# Altium schematic sheet mcu.SchDoc
size A3; SheetNumber: 2; SheetTotal: 7
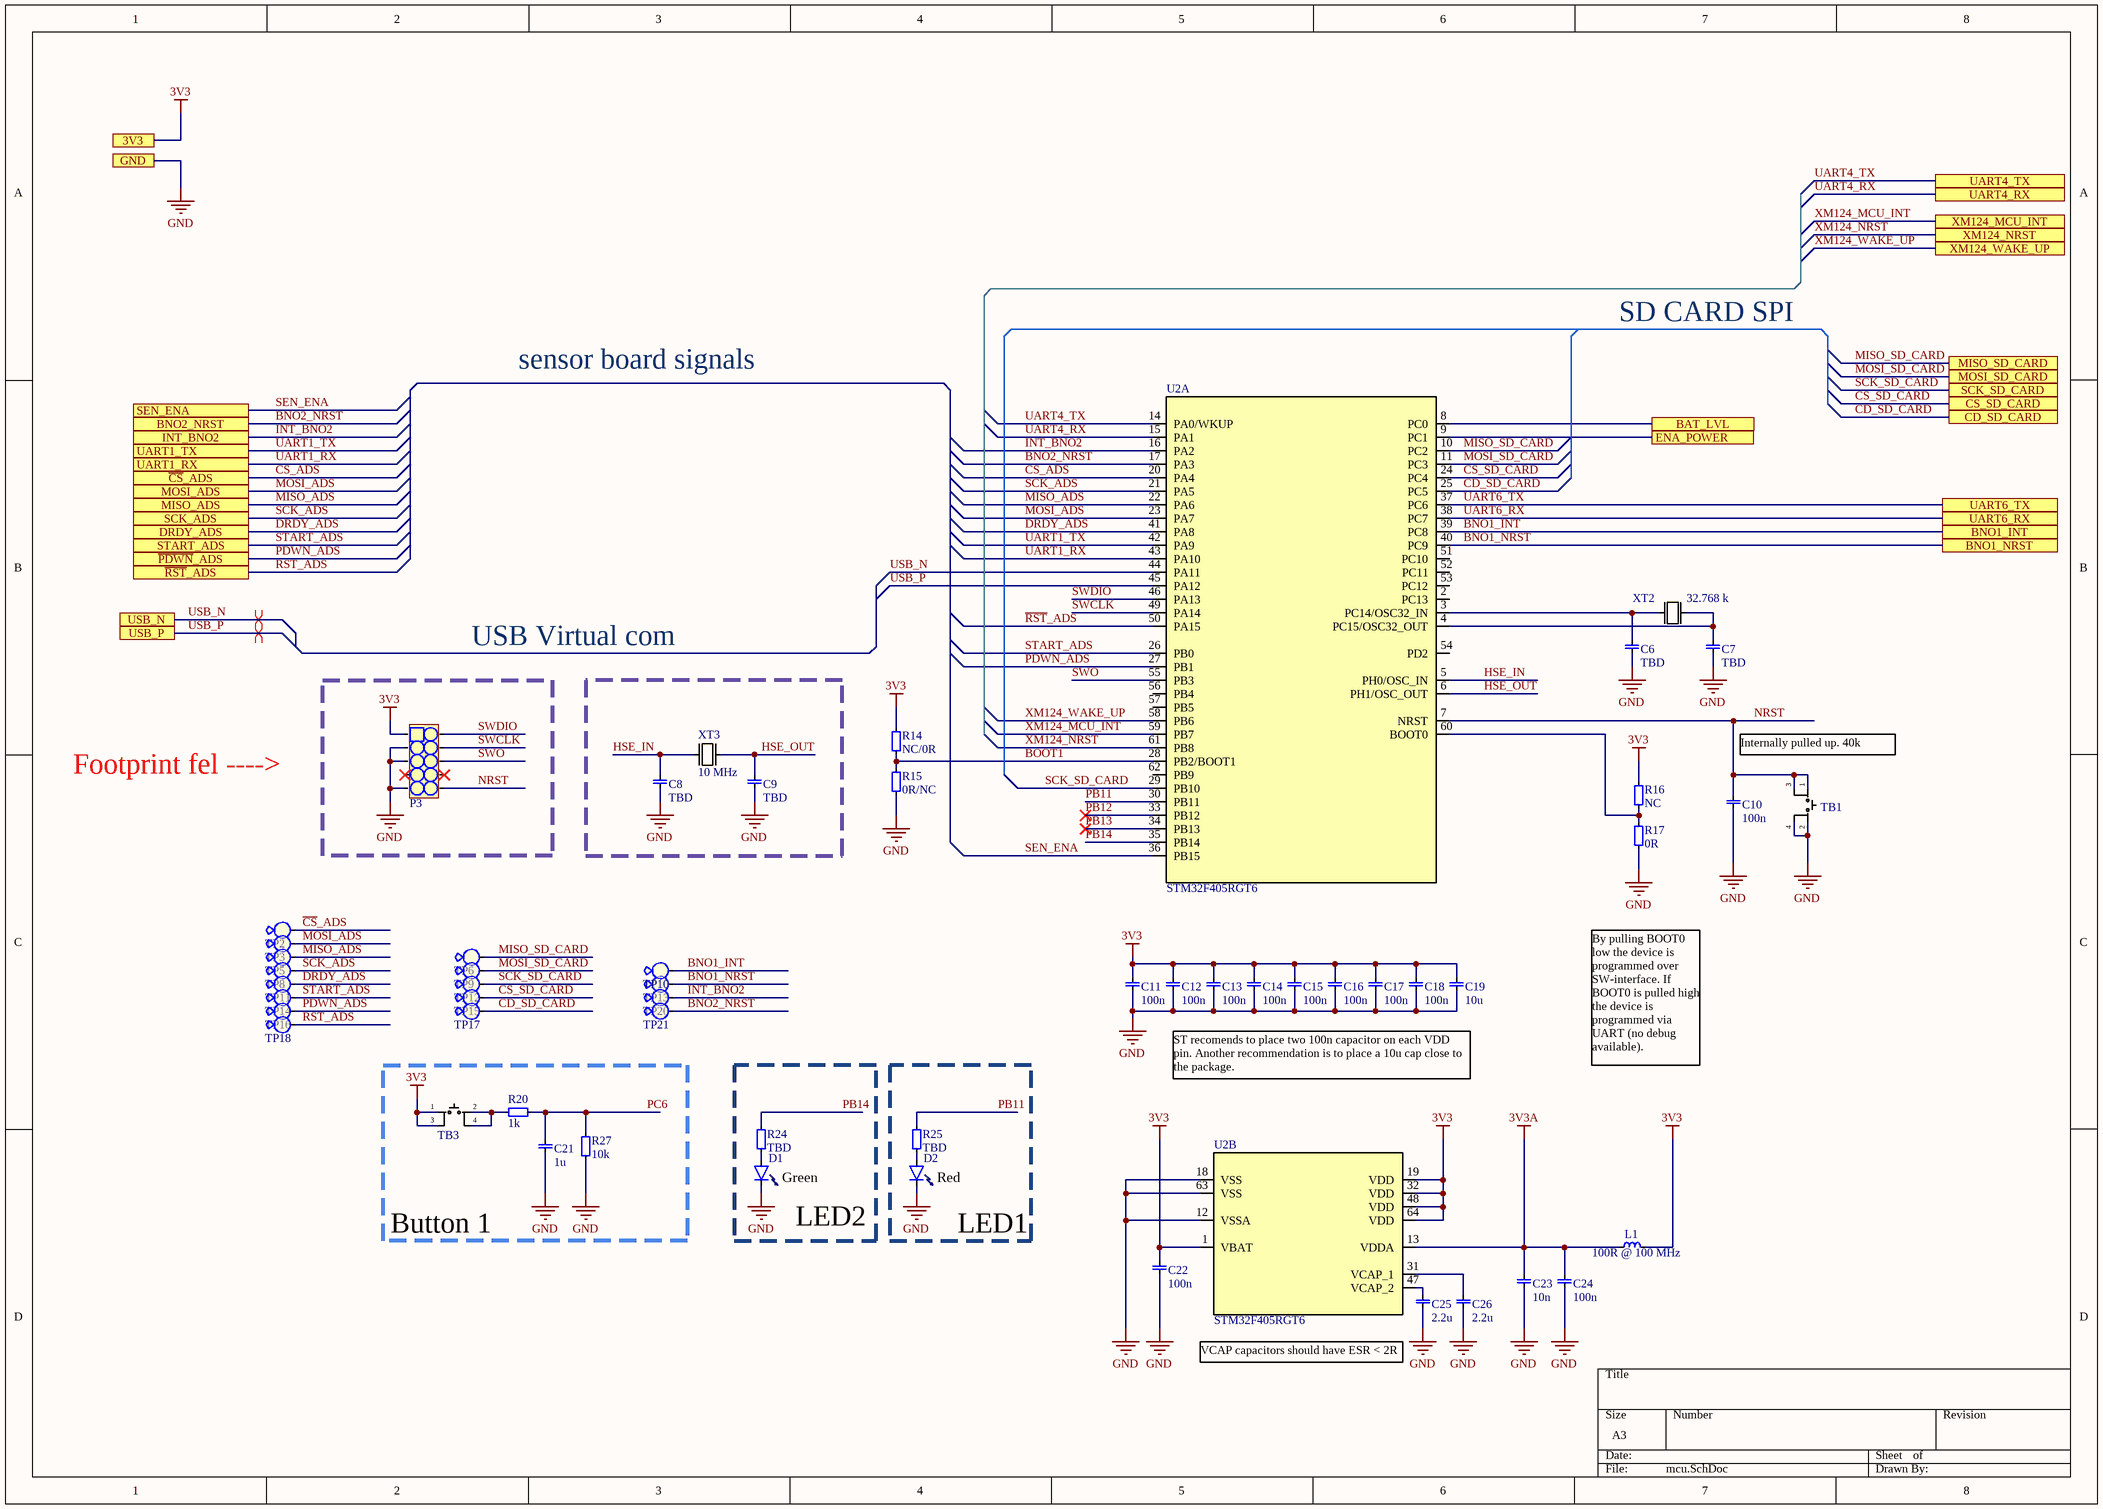
[diagram p0: mcu.SchDoc]

## Parts
C6  value TBD  [0603 cap]  (hidden comment: 0603, capacitor)
C7  value TBD  [0603 cap]  (hidden comment: 0603, capacitor)
C8  value TBD  [0603 cap]  (hidden comment: 0603, capacitor)
C9  value TBD  [0603 cap]  (hidden comment: 0603, capacitor)
C10  value 100n  [0402 CAP]  (hidden comment: 0603, capacitor)
C11  value 100n  [0402 CAP]  (hidden comment: 0603, capacitor)
C12  value 100n  [0402 CAP]  (hidden comment: 0603, capacitor)
C13  value 100n  [0402 CAP]  (hidden comment: 0603, capacitor)
C14  value 100n  [0402 CAP]  (hidden comment: 0603, capacitor)
C15  value 100n  [0402 CAP]  (hidden comment: 0603, capacitor)
C16  value 100n  [0402 CAP]  (hidden comment: 0603, capacitor)
C17  value 100n  [0402 CAP]  (hidden comment: 0603, capacitor)
C18  value 100n  [0402 CAP]  (hidden comment: 0603, capacitor)
C19  value 10u  [0402 CAP]  (hidden comment: 0603, capacitor)
C21  value 1u  [0402 CAP]  (hidden comment: 0603, capacitor)
C22  value 100n  [0402 CAP]  (hidden comment: 0603, capacitor)
C23  value 10n  [0402 CAP]  (hidden comment: 0603, capacitor)
C24  value 100n  [0402 CAP]  (hidden comment: 0603, capacitor)
C25  value 2.2u  [0402 CAP]  (hidden comment: 0603, capacitor)
C26  value 2.2u  [0402 CAP]  (hidden comment: 0603, capacitor)
D1  0603, LED  [0603 LED]  (value not drawn)
D2  0603, LED  [0603 LED]  (value not drawn)
L1  value 100R @ 100 MHz  [0805]  (hidden comment: 0805, Ferrite Bead)
P3  ARM 10 pin SWD  [FTSH-105-01-L-DV-K even odd]  (value not drawn)
R14  value NC/0R  [0402 res]  (hidden comment: 0603, resistor)
R15  value 0R/NC  [0402 res]  (hidden comment: 0603, resistor)
R16  value NC  [0402 res]  (hidden comment: 0603, resistor)
R17  value 0R  [0402 res]  (hidden comment: 0603, resistor)
R20  value 1k  [0402 res]  (hidden comment: 0603, resistor)
R24  value TBD  [0402 res]  (hidden comment: 0603, resistor)
R25  value TBD  [0402 res]  (hidden comment: 0603, resistor)
R27  value 10k  [0402 res]  (hidden comment: 0603, resistor)
TB1  Tactile Button  [tacButton smd]  (value not drawn)
TB3  Tactile Button  [tacButton smd]  (value not drawn)
TP2  Test Point  [testPoint]  (value not drawn)
TP3  Test Point  [testPoint]  (value not drawn)
TP5  Test Point  [testPoint]  (value not drawn)
TP6  Test Point  [testPoint]  (value not drawn)
TP8  Test Point  [testPoint]  (value not drawn)
TP9  Test Point  [testPoint]  (value not drawn)
TP10  Test Point  [testPoint]  (value not drawn)
TP11  Test Point  [testPoint]  (value not drawn)
TP12  Test Point  [testPoint]  (value not drawn)
TP13  Test Point  [testPoint]  (value not drawn)
TP14  Test Point  [testPoint]  (value not drawn)
TP15  Test Point  [testPoint]  (value not drawn)
TP16  Test Point  [testPoint]  (value not drawn)
TP17  Test Point  [testPoint]  (value not drawn)
TP18  Test Point  [testPoint]  (value not drawn)
TP20  Test Point  [testPoint]  (value not drawn)
TP21  Test Point  [testPoint]  (value not drawn)
U2  STM32F405RGT6  [LQFP64-10x10mm_s]  (parts A,B of 2)
XT2  value 32.768 k  [ECS-.327-12.5-39-TR]  (hidden comment: Crystal)
XT3  value 10 MHz  [XTAL_SMD_LP]  (hidden comment: XTAL TXC 7A)

## Blocks framed on the sheet
Button 1: C21 R20 R27 TB3
LED2: D1 R24
LED1: D2 R25

## Ports
3V3, BAT_LVL, BNO1_INT, BNO1_NRST, BNO2_NRST, CD_SD_CARD, CS_SD_CARD, DRDY_ADS, ENA_POWER, GND, INT_BNO2, MISO_ADS, MISO_SD_CARD, MOSI_ADS, MOSI_SD_CARD, SCK_ADS, SCK_SD_CARD, SEN_ENA, START_ADS, UART1_RX, UART1_TX, UART4_RX, UART4_TX, UART6_RX, UART6_TX, USB_N, USB_P, XM124_MCU_INT, XM124_NRST, XM124_WAKE_UP, ~{CS}_ADS, ~{PDWN}_ADS, ~{RST}_ADS

## Nets
3V3: C11.1 C12.1 C13.1 C14.1 C15.1 C16.1 C17.1 C18.1 C19.1 C22.1 L1.0 P3.1 R14.0 R16.0 TB3.1 TB3.3 U2.1(VBAT) U2.19(VDD) U2.32(VDD) U2.48(VDD) U2.64(VDD) ; port 3V3
3V3A: C23.1 C24.1 L1.1 U2.13(VDDA)
GND: C6.0 C7.0 C8.0 C9.0 C10.0 C11.0 C12.0 C13.0 C14.0 C15.0 C16.0 C17.0 C18.0 C19.0 C21.0 C22.0 C23.0 C24.0 C25.0 C26.0 D1.0(Cathode) D2.0(Cathode) P3.3 P3.5 P3.9 R15.1 R17.1 R27.0 TB1.2 TB1.4 U2.12(VSSA) U2.18(VSS) U2.63(VSS) ; port GND
BAT_LVL: U2.8(PC0) ; port BAT_LVL
BNO1_INT: TP10.0 U2.39(PC8) ; port BNO1_INT
BNO1_NRST: TP13.0 U2.40(PC9) ; port BNO1_NRST
BNO2_NRST: TP21.0 U2.17(PA3) ; port BNO2_NRST
BOOT1: R14.1 R15.0 U2.28(PB2/BOOT1)
~{CS}_ADS: TP2.0 U2.20(PA4) ; port ~{CS}_ADS
CD_SD_CARD: TP17.0 U2.25(PC5) ; port CD_SD_CARD
CS_SD_CARD: TP15.0 U2.24(PC4) ; port CS_SD_CARD
DRDY_ADS: TP11.0 U2.41(PA8) ; port DRDY_ADS
ENA_POWER: U2.9(PC1) ; port ENA_POWER
HSE_IN: C8.1 U2.5(PH0/OSC_IN) XT3.1
HSE_OUT: C9.1 U2.6(PH1/OSC_OUT) XT3.2
INT_BNO2: TP20.0 U2.16(PA2) ; port INT_BNO2
MISO_ADS: TP5.0 U2.22(PA6) ; port MISO_ADS
MISO_SD_CARD: TP6.0 U2.10(PC2) ; port MISO_SD_CARD
MOSI_ADS: TP3.0 U2.23(PA7) ; port MOSI_ADS
MOSI_SD_CARD: TP9.0 U2.11(PC3) ; port MOSI_SD_CARD
NRST: C10.1 P3.10 TB1.1 TB1.3 U2.7(NRST)
~{PDWN}_ADS: TP16.0 U2.27(PB1) ; port ~{PDWN}_ADS
PB11: R25.1 U2.30(PB11)
PB12: U2.33(PB12)
PB13: U2.34(PB13)
PB14: R24.1 U2.35(PB14)
PC6: C21.1 R20.1 R27.1
~{RST}_ADS: TP18.0 U2.50(PA15) ; port ~{RST}_ADS
SCK_ADS: TP8.0 U2.21(PA5) ; port SCK_ADS
SCK_SD_CARD: TP12.0 U2.29(PB10) ; port SCK_SD_CARD
SEN_ENA: U2.36(PB15) ; port SEN_ENA
START_ADS: TP14.0 U2.26(PB0) ; port START_ADS
SWCLK: P3.4 U2.49(PA14)
SWDIO: P3.2 U2.46(PA13)
SWO: P3.6 U2.55(PB3)
UART1_RX: U2.43(PA10) ; port UART1_RX
UART1_TX: U2.42(PA9) ; port UART1_TX
UART4_RX: U2.15(PA1) ; port UART4_RX
UART4_TX: U2.14(PA0/WKUP) ; port UART4_TX
UART6_RX: U2.38(PC7) ; port UART6_RX
UART6_TX: U2.37(PC6) ; port UART6_TX
USB_N: U2.44(PA11) ; port USB_N
USB_P: U2.45(PA12) ; port USB_P
XM124_MCU_INT: U2.59(PB7) ; port XM124_MCU_INT
XM124_NRST: U2.61(PB8) ; port XM124_NRST
XM124_WAKE_UP: U2.58(PB6) ; port XM124_WAKE_UP
NetC6_1: C6.1 U2.3(PC14/OSC32_IN) XT2.1
NetC7_1: C7.1 U2.4(PC15/OSC32_OUT) XT2.2
NetC25_1: C25.1 U2.47(VCAP_2)
NetC26_1: C26.1 U2.31(VCAP_1)
NetD1_1: D1.1 R24.0
NetD2_1: D2.1 R25.0
NetR16_1: R16.1 R17.0 U2.60(BOOT0)
NetR20_0: R20.0 TB3.2 TB3.4

Not connected (* = marked no-connect by the designer): P3 7* 8*; U2 2(PC13) 51(PC10) 52(PC11) 53(PC12) 54(PD2) 56(PB4) 57(PB5) 62(PB9)

## Layout directives
differential pair: USB_N, USB_P

## Notes on the sheet
- sensor board signals
- SD CARD SPI
- USB Virtual com
- Footprint fel ---->
- Internally pulled up. 40k
- ST recomends to place two 100n capacitor on each VDD pin. Another recommendation is to place a 10u cap close to the package.
- By pulling BOOT0 low the device is programmed over SW-interface. If BOOT0 is pulled high the device is programmed via UART (no debug available).
- Green
- Red
- VCAP capacitors should have ESR < 2R

## Library data of the parts
C10-C18 C22 C24 = 0603, capacitor: Manufacturer Part No: GRM155R62A104KE14D; Order number: *
C19 = 0603, capacitor: Manufacturer Part No: GRM155R61A106ME11D; Order number: *
C21 = 0603, capacitor: Manufacturer Part No: C0402C105K9PAC7867; Order number: *
C23 = 0603, capacitor: Manufacturer Part No: CC0402KRX7R0BB103; Order number: *
C25 C26 = 0603, capacitor: Manufacturer Part No: GRM155D71A225ME15D; Order number: *
D1 = 0603, LED: Manufacturer Part No: 5988081107F
D2 = 0603, LED: Manufacturer Part No: 150060SS75003
L1 = 0805, Ferrite Bead: Manufacturer Part No: 74279207; Order number: 732-4624-1-ND; Supplier: Digikey
P3 = ARM 10 pin SWD: 1.27mm, PH; Manufacturer Part No: FTSH-105-01-L-DV-K; Value: 2x5 Pin Header, 2.54mm, Th; Digikey: FTSH-105-01-L-DV-K
R14 R15 R17 = 0603, resistor: Manufacturer Part No: RMCF0402ZT0R00
R20 = 0603, resistor: Manufacturer Part No: RC0402FR-071KL
R27 = 0603, resistor: Manufacturer Part No: 311-10.0KLRCT-ND
TB1 TB3 = TacButton SMD: Tactile Switch Small Low; Manufacturer Part No: 430182043816; ELFA: 110-87-406; Value: Button SMD
U2 = STM32F405RGT6: No Description Available; Vendor: STMicroelectronics; Built_By: EMA_UL_Team; SourceLibrary: Updates_to_database_2020-10-19; Manufacturer Part Number: STM32F405RGT6; Copyright: Copyright (C) 2018 Accelerated Designs. All rights reserved; RefDes: RefDes; Type: DEV; Manufacturer Part No: STM32F405RGT6
XT2 = Crystal: Manufacturer Part No: CC4V-T1A-32.768KHZ-9PF-20PPM-TA-QC; Order number: 2195-CC4V-T1A-32.768KHZ-9PF-20PPM-TA-QCCT-ND; Supplier: Digikey
XT3 = XTAL TXC 7A: 16 MHz, SMD, 5mm x 3,2mm, 30 ppm; Manufacturer Part No: 7A-10.000MAAJ-T; Order number: 1841939; Supplier: Farnell
C6-C9 = 0603, capacitor: Order number: *
TP2 TP3 TP5 TP6 TP8-TP18 TP20 TP21 = Test Point: Value: Test point; Farnell: 1702006